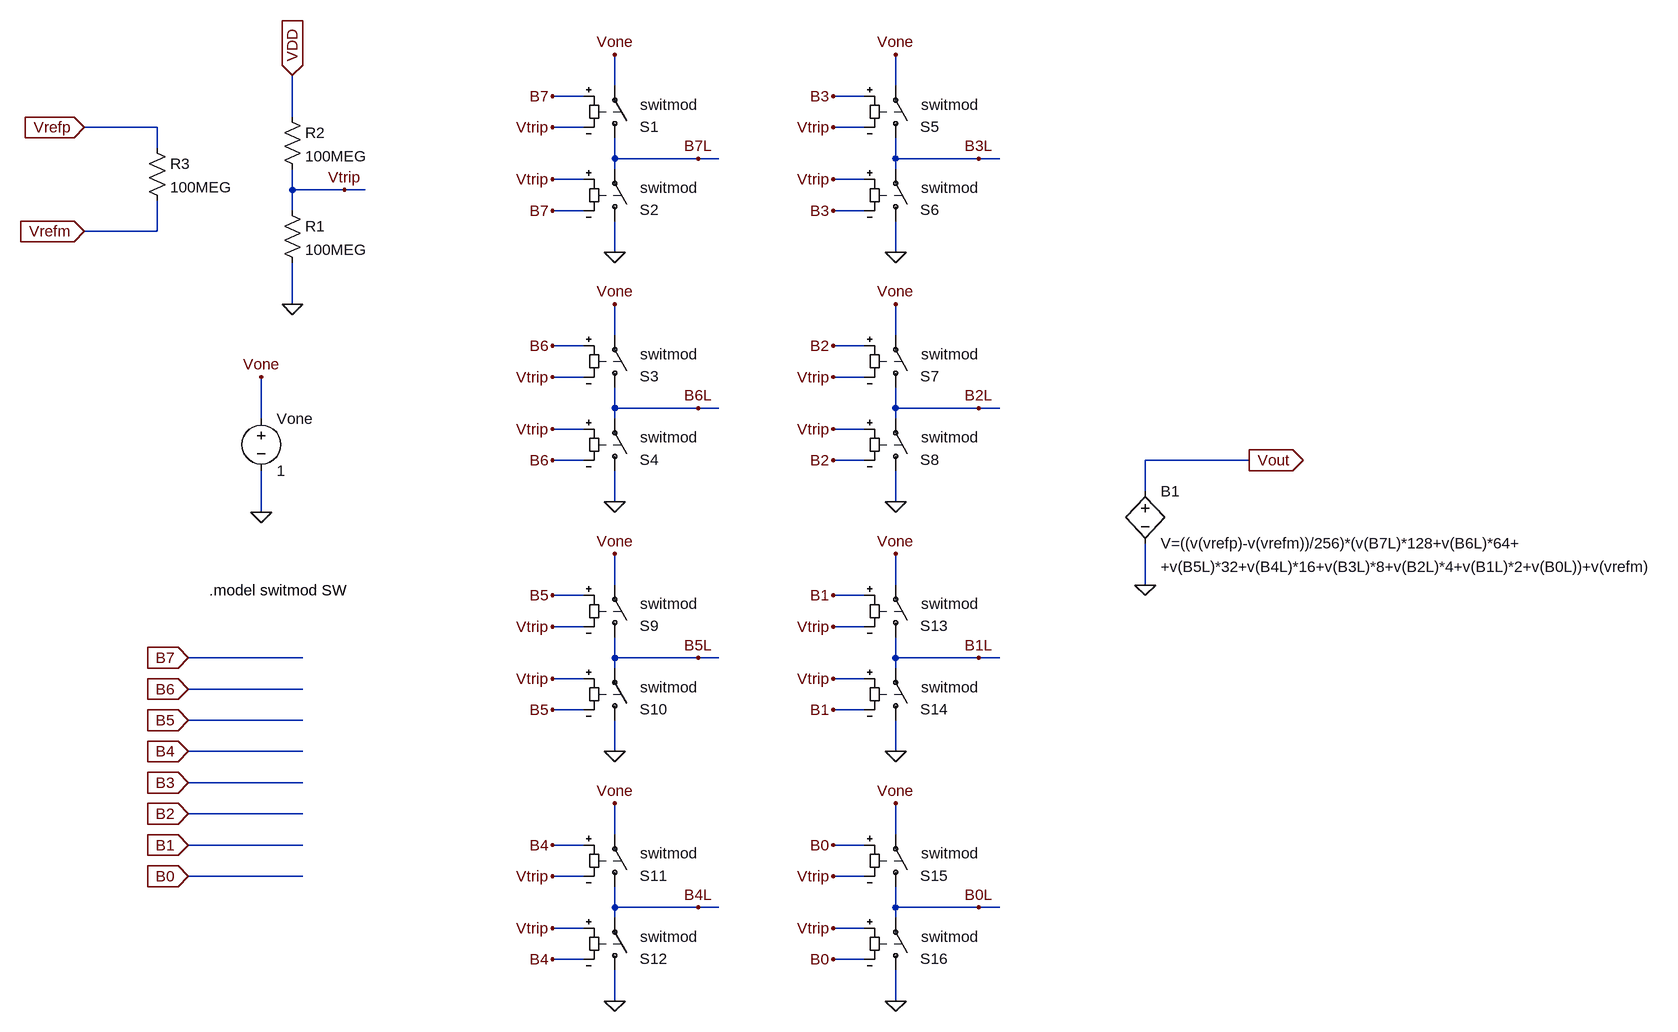
[diagram p0: schematic Ideal_8_bit_DAC.asc]
Ideal_8_bit_DAC.asc, the LTspice schematic file:
Version 4
SHEET 1 2732 1316
WIRE 320 -176 208 -176
WIRE 320 -144 320 -176
WIRE 320 -16 208 -16
WIRE 320 -16 320 -64
WIRE 480 272 480 208
WIRE 480 416 480 352
WIRE 528 -192 528 -256
WIRE 528 -80 528 -112
WIRE 528 -48 528 -80
WIRE 528 96 528 32
WIRE 544 640 368 640
WIRE 544 688 368 688
WIRE 544 736 368 736
WIRE 544 784 368 784
WIRE 544 832 368 832
WIRE 544 880 368 880
WIRE 544 928 368 928
WIRE 544 976 368 976
WIRE 608 -80 528 -80
WIRE 640 -80 608 -80
WIRE 976 -224 928 -224
WIRE 976 -176 928 -176
WIRE 976 -96 928 -96
WIRE 976 -48 928 -48
WIRE 976 160 928 160
WIRE 976 208 928 208
WIRE 976 288 928 288
WIRE 976 336 928 336
WIRE 976 544 928 544
WIRE 976 592 928 592
WIRE 976 672 928 672
WIRE 976 720 928 720
WIRE 976 928 928 928
WIRE 976 976 928 976
WIRE 976 1056 928 1056
WIRE 976 1104 928 1104
WIRE 1024 -240 1024 -288
WIRE 1024 -128 1024 -160
WIRE 1024 -112 1024 -128
WIRE 1024 16 1024 -32
WIRE 1024 144 1024 96
WIRE 1024 256 1024 224
WIRE 1024 272 1024 256
WIRE 1024 400 1024 352
WIRE 1024 528 1024 480
WIRE 1024 640 1024 608
WIRE 1024 656 1024 640
WIRE 1024 784 1024 736
WIRE 1024 912 1024 864
WIRE 1024 1024 1024 992
WIRE 1024 1040 1024 1024
WIRE 1024 1168 1024 1120
WIRE 1152 -128 1024 -128
WIRE 1152 256 1024 256
WIRE 1152 640 1024 640
WIRE 1152 1024 1024 1024
WIRE 1184 -128 1152 -128
WIRE 1184 256 1152 256
WIRE 1184 640 1152 640
WIRE 1184 1024 1152 1024
WIRE 1408 -224 1360 -224
WIRE 1408 -176 1360 -176
WIRE 1408 -96 1360 -96
WIRE 1408 -48 1360 -48
WIRE 1408 160 1360 160
WIRE 1408 208 1360 208
WIRE 1408 288 1360 288
WIRE 1408 336 1360 336
WIRE 1408 544 1360 544
WIRE 1408 592 1360 592
WIRE 1408 672 1360 672
WIRE 1408 720 1360 720
WIRE 1408 928 1360 928
WIRE 1408 976 1360 976
WIRE 1408 1056 1360 1056
WIRE 1408 1104 1360 1104
WIRE 1456 -240 1456 -288
WIRE 1456 -128 1456 -160
WIRE 1456 -112 1456 -128
WIRE 1456 16 1456 -32
WIRE 1456 144 1456 96
WIRE 1456 256 1456 224
WIRE 1456 272 1456 256
WIRE 1456 400 1456 352
WIRE 1456 528 1456 480
WIRE 1456 640 1456 608
WIRE 1456 656 1456 640
WIRE 1456 784 1456 736
WIRE 1456 912 1456 864
WIRE 1456 1024 1456 992
WIRE 1456 1040 1456 1024
WIRE 1456 1168 1456 1120
WIRE 1584 -128 1456 -128
WIRE 1584 256 1456 256
WIRE 1584 640 1456 640
WIRE 1584 1024 1456 1024
WIRE 1616 -128 1584 -128
WIRE 1616 256 1584 256
WIRE 1616 640 1584 640
WIRE 1616 1024 1584 1024
WIRE 1840 384 1840 336
WIRE 1840 528 1840 464
WIRE 2000 336 1840 336
FLAG 928 -224 B7
FLAG 928 -176 Vtrip
FLAG 608 -80 Vtrip
FLAG 528 -256 VDD
IOPIN 528 -256 In
FLAG 928 -96 Vtrip
FLAG 928 -48 B7
FLAG 1152 -128 B7L
FLAG 1024 16 0
FLAG 928 160 B6
FLAG 928 208 Vtrip
FLAG 928 288 Vtrip
FLAG 928 336 B6
FLAG 1152 256 B6L
FLAG 1024 400 0
FLAG 1360 -224 B3
FLAG 1360 -176 Vtrip
FLAG 1360 -96 Vtrip
FLAG 1360 -48 B3
FLAG 1584 -128 B3L
FLAG 1456 16 0
FLAG 1360 160 B2
FLAG 1360 208 Vtrip
FLAG 1360 288 Vtrip
FLAG 1360 336 B2
FLAG 1584 256 B2L
FLAG 1456 400 0
FLAG 928 544 B5
FLAG 928 592 Vtrip
FLAG 928 672 Vtrip
FLAG 928 720 B5
FLAG 1152 640 B5L
FLAG 1024 784 0
FLAG 928 928 B4
FLAG 928 976 Vtrip
FLAG 928 1056 Vtrip
FLAG 928 1104 B4
FLAG 1152 1024 B4L
FLAG 1024 1168 0
FLAG 1360 544 B1
FLAG 1360 592 Vtrip
FLAG 1360 672 Vtrip
FLAG 1360 720 B1
FLAG 1584 640 B1L
FLAG 1456 784 0
FLAG 1360 928 B0
FLAG 1360 976 Vtrip
FLAG 1360 1056 Vtrip
FLAG 1360 1104 B0
FLAG 1584 1024 B0L
FLAG 1456 1168 0
FLAG 1840 528 0
FLAG 2000 336 Vout
IOPIN 2000 336 Out
FLAG 208 -176 Vrefp
IOPIN 208 -176 In
FLAG 208 -16 Vrefm
IOPIN 208 -16 In
FLAG 368 640 B7
IOPIN 368 640 In
FLAG 368 688 B6
IOPIN 368 688 In
FLAG 368 736 B5
IOPIN 368 736 In
FLAG 368 784 B4
IOPIN 368 784 In
FLAG 368 832 B3
IOPIN 368 832 In
FLAG 368 880 B2
IOPIN 368 880 In
FLAG 368 928 B1
IOPIN 368 928 In
FLAG 368 976 B0
IOPIN 368 976 In
FLAG 528 96 0
FLAG 480 416 0
FLAG 480 208 Vone
FLAG 1024 -288 Vone
FLAG 1456 -288 Vone
FLAG 1456 96 Vone
FLAG 1024 96 Vone
FLAG 1024 480 Vone
FLAG 1456 480 Vone
FLAG 1456 864 Vone
FLAG 1024 864 Vone
SYMBOL sw 1024 -144 M180
WINDOW 3 24 -12 Left 0
WINDOW 38 39 67 Left 0
WINDOW 0 38 33 Left 0
SYMATTR Value ""
SYMATTR SpiceModel switmod
SYMATTR InstName S1
SYMBOL res 512 -64 R0
SYMATTR InstName R1
SYMATTR Value 100MEG
SYMBOL res 512 -208 R0
SYMATTR InstName R2
SYMATTR Value 100MEG
SYMBOL sw 1024 -16 M180
WINDOW 3 24 -12 Left 0
WINDOW 38 39 67 Left 0
WINDOW 0 38 33 Left 0
SYMATTR Value ""
SYMATTR SpiceModel switmod
SYMATTR InstName S2
SYMBOL sw 1024 240 M180
WINDOW 3 24 -12 Left 0
WINDOW 38 39 67 Left 0
WINDOW 0 38 33 Left 0
SYMATTR Value ""
SYMATTR SpiceModel switmod
SYMATTR InstName S3
SYMBOL sw 1024 368 M180
WINDOW 3 24 -12 Left 0
WINDOW 38 39 67 Left 0
WINDOW 0 38 33 Left 0
SYMATTR Value ""
SYMATTR SpiceModel switmod
SYMATTR InstName S4
SYMBOL sw 1456 -144 M180
WINDOW 3 24 -12 Left 0
WINDOW 38 39 67 Left 0
WINDOW 0 38 33 Left 0
SYMATTR Value ""
SYMATTR SpiceModel switmod
SYMATTR InstName S5
SYMBOL sw 1456 -16 M180
WINDOW 3 24 -12 Left 0
WINDOW 38 39 67 Left 0
WINDOW 0 38 33 Left 0
SYMATTR Value ""
SYMATTR SpiceModel switmod
SYMATTR InstName S6
SYMBOL sw 1456 240 M180
WINDOW 3 24 -12 Left 0
WINDOW 38 39 67 Left 0
WINDOW 0 38 33 Left 0
SYMATTR Value ""
SYMATTR SpiceModel switmod
SYMATTR InstName S7
SYMBOL sw 1456 368 M180
WINDOW 3 24 -12 Left 0
WINDOW 38 39 67 Left 0
WINDOW 0 38 33 Left 0
SYMATTR Value ""
SYMATTR SpiceModel switmod
SYMATTR InstName S8
SYMBOL sw 1024 624 M180
WINDOW 3 24 -12 Left 0
WINDOW 38 39 67 Left 0
WINDOW 0 38 33 Left 0
SYMATTR Value ""
SYMATTR SpiceModel switmod
SYMATTR InstName S9
SYMBOL sw 1024 752 M180
WINDOW 3 24 -12 Left 0
WINDOW 38 39 67 Left 0
WINDOW 0 38 33 Left 0
SYMATTR Value ""
SYMATTR SpiceModel switmod
SYMATTR InstName S10
SYMBOL sw 1024 1008 M180
WINDOW 3 24 -12 Left 0
WINDOW 38 39 67 Left 0
WINDOW 0 38 33 Left 0
SYMATTR Value ""
SYMATTR SpiceModel switmod
SYMATTR InstName S11
SYMBOL sw 1024 1136 M180
WINDOW 3 24 -12 Left 0
WINDOW 38 39 67 Left 0
WINDOW 0 38 33 Left 0
SYMATTR Value ""
SYMATTR SpiceModel switmod
SYMATTR InstName S12
SYMBOL sw 1456 624 M180
WINDOW 3 24 -12 Left 0
WINDOW 38 39 67 Left 0
WINDOW 0 38 33 Left 0
SYMATTR Value ""
SYMATTR SpiceModel switmod
SYMATTR InstName S13
SYMBOL sw 1456 752 M180
WINDOW 3 24 -12 Left 0
WINDOW 38 39 67 Left 0
WINDOW 0 38 33 Left 0
SYMATTR Value ""
SYMATTR SpiceModel switmod
SYMATTR InstName S14
SYMBOL sw 1456 1008 M180
WINDOW 3 24 -12 Left 0
WINDOW 38 39 67 Left 0
WINDOW 0 38 33 Left 0
SYMATTR Value ""
SYMATTR SpiceModel switmod
SYMATTR InstName S15
SYMBOL sw 1456 1136 M180
WINDOW 3 24 -12 Left 0
WINDOW 38 39 67 Left 0
WINDOW 0 38 33 Left 0
SYMATTR Value ""
SYMATTR SpiceModel switmod
SYMATTR InstName S16
SYMBOL bv 1840 368 R0
WINDOW 123 24 132 Left 0
SYMATTR Value2 +v(B5L)*32+v(B4L)*16+v(B3L)*8+v(B2L)*4+v(B1L)*2+v(B0L))+v(vrefm)
SYMATTR InstName B1
SYMATTR Value V=((v(vrefp)-v(vrefm))/256)*(v(B7L)*128+v(B6L)*64+
SYMBOL res 304 -160 R0
SYMATTR InstName R3
SYMATTR Value 100MEG
SYMBOL voltage 480 256 R0
WINDOW 123 0 0 Left 0
WINDOW 39 0 0 Left 0
SYMATTR InstName Vone
SYMATTR Value 1
TEXT 400 536 Left 0 !.model switmod SW

The netlist it stands for:
* Ideal_8_bit_DAC.asc
S1 B7L Vone B7 Vtrip switmod
R1 Vtrip 0 100MEG
R2 VDD Vtrip 100MEG
S2 0 B7L Vtrip B7 switmod
S3 B6L Vone B6 Vtrip switmod
S4 0 B6L Vtrip B6 switmod
S5 B3L Vone B3 Vtrip switmod
S6 0 B3L Vtrip B3 switmod
S7 B2L Vone B2 Vtrip switmod
S8 0 B2L Vtrip B2 switmod
S9 B5L Vone B5 Vtrip switmod
S10 0 B5L Vtrip B5 switmod
S11 B4L Vone B4 Vtrip switmod
S12 0 B4L Vtrip B4 switmod
S13 B1L Vone B1 Vtrip switmod
S14 0 B1L Vtrip B1 switmod
S15 B0L Vone B0 Vtrip switmod
S16 0 B0L Vtrip B0 switmod
B1 Vout 0 V=((v(vrefp)-v(vrefm))/256)*(v(B7L)*128+v(B6L)*64+ +v(B5L)*32+v(B4L)*16+v(B3L)*8+v(B2L)*4+v(B1L)*2+v(B0L))+v(vrefm)
R3 Vrefp Vrefm 100MEG
Vone Vone 0 1
.model switmod SW
.backanno
.end